# Altium schematic sheet Function.SchDoc
size A4; SheetNumber: 1; SheetTotal: 5
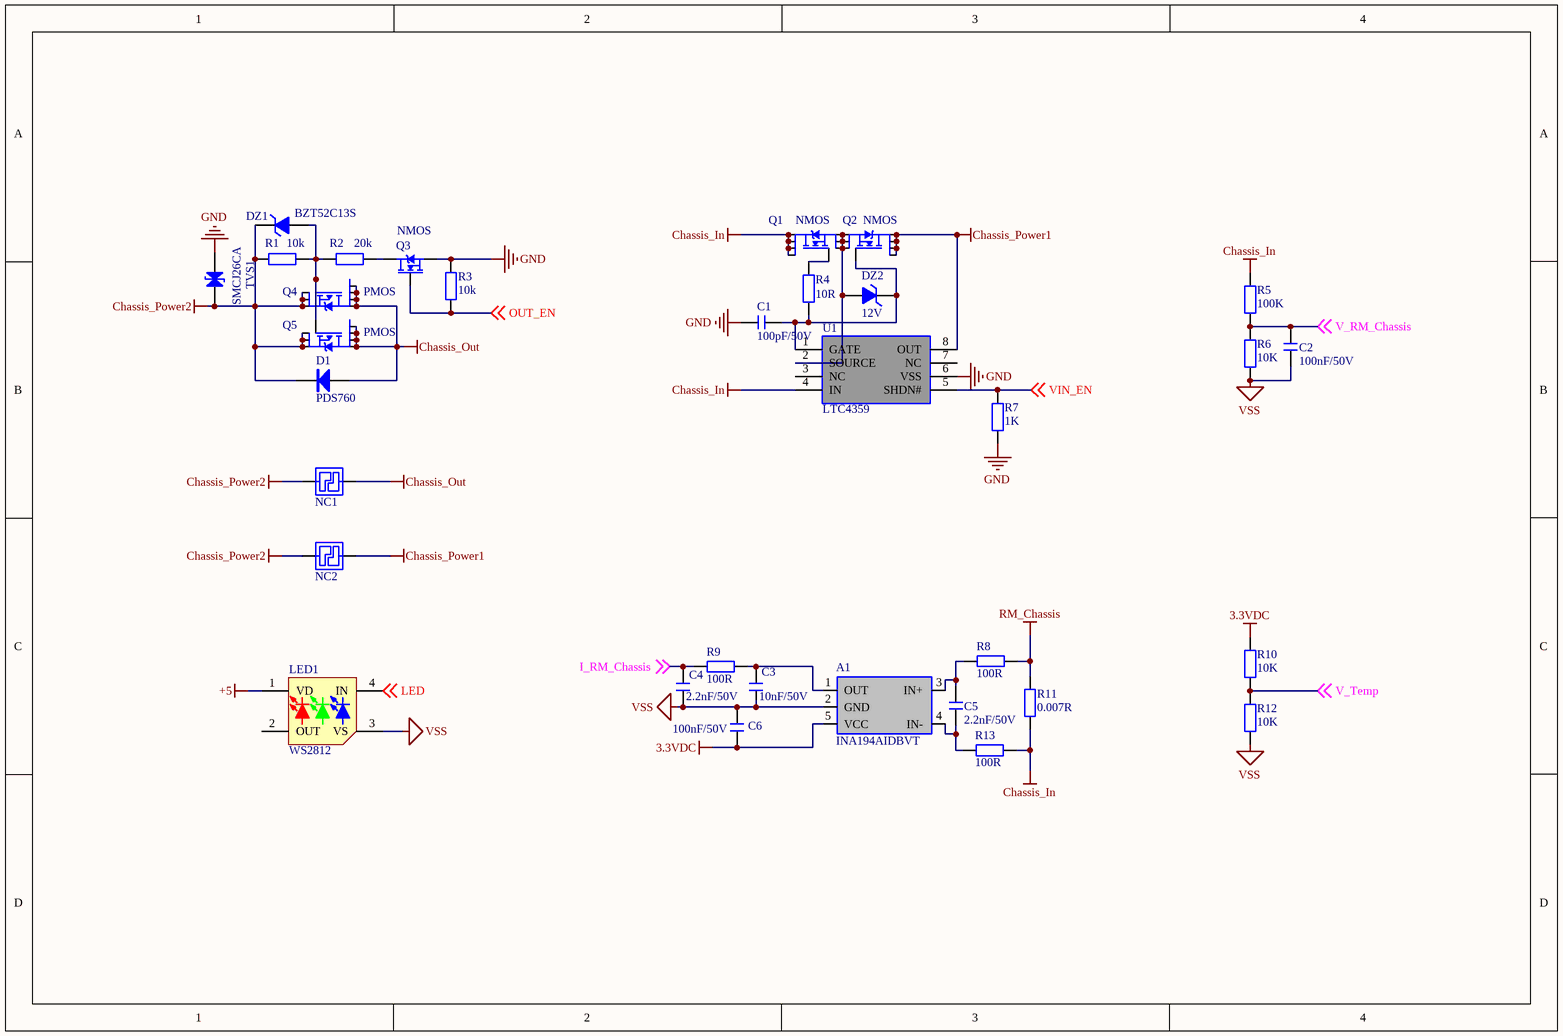
[diagram p0: Function.SchDoc]

## Parts
A1  INA194AIDBVT  [SOT23-5]
C1  100pF/50V  [C 0603_L]
C2  100nF/50V  [C 0603_L]
C3  10nF/50V  [C 0603_L]
C4  2.2nF/50V  [C 0603_L]
C5  2.2nF/50V  [C 0603_L]
C6  100nF/50V  [C 0603_L]
D1  PDS760  [SMPC]
DZ1  BZT52C13S  [SOD-323]
DZ2  12V  [SOD-323]
LED1  WS2812  [LED 3528-RGB]
NC1  NODE  [NODE-2]  (value not drawn)
NC2  NODE  [NODE-3]  (value not drawn)
Q1  NMOS  [DFN5*6-8L]
Q2  NMOS  [DFN5*6-8L]
Q3  NMOS  [SOT23-3L]
Q4  PMOS  [DFN5*6-8L]
Q5  PMOS  [DFN5*6-8L]
R1  10k  [R 0603_L]
R2  20k  [R 0603_L]
R3  10k  [R 0603_L]
R4  10R  [R 0603_L]
R5  100K  [R 0603_L]
R6  10K  [R 0603_L]
R7  1K  [R 0603_L]
R8  100R  [R 0603_L]
R9  100R  [R 0603_L]
R10  10K  [R 0603_L]
R11  0.007R  [R 2512_M]
R12  10K  [R 0603_L]
R13  100R  [R 0603_L]
TVS1  SMCJ26CA  [SMC]
U1  LTC4359  [MSOP8_L]

## Nets
3.3VDC: A1.5(VCC) C6.2 R10.1
+5: LED1.1(VD)
Chassis_In: Q1.5(D) Q1.6(D) Q1.7(D) Q1.8(D) R5.1 R11.2 R13.2 U1.4(IN)
Chassis_Out: D1.1(A) NC1.2 Q4.5(D) Q4.6(D) Q4.7(D) Q4.8(D) Q5.5(D) Q5.6(D) Q5.7(D) Q5.8(D)
Chassis_Power1: NC2.2 Q2.5(D) Q2.6(D) Q2.7(D) Q2.8(D) U1.8(OUT)
Chassis_Power2: D1.2(K) DZ1.2(K) NC1.1 NC2.1 Q4.1(S) Q4.2(S) Q4.3(S) Q5.1(S) Q5.2(S) Q5.3(S) R1.2 TVS1.2(K)
GND: C1.2 Q3.3(S) R3.1 R7.1 TVS1.1(A) U1.6(VSS)
RM_Chassis: R8.2 R11.1
VSS: A1.2(GND) C2.1 C3.2 C4.2 C6.1 LED1.3(VS) R6.2 R12.2
I_RM_Chassis: C4.1 R9.2 ; off-sheet I_RM_Chassis
LED: LED1.4(IN) ; off-sheet LED
OUT_EN: Q3.1(G) R3.2 ; off-sheet OUT_EN
V_RM_Chassis: C2.2 R5.2 R6.1 ; off-sheet V_RM_Chassis
V_Temp: R10.2 R12.1 ; off-sheet V_Temp
VIN_EN: R7.2 U1.5(SHDN#) ; off-sheet VIN_EN
NetA1_1: A1.1(OUT) C3.1 R9.1
NetA1_3: A1.3(IN+) C5.1 R8.1
NetA1_4: A1.4(IN-) C5.2 R13.1
NetC1_1: C1.1 DZ2.2(K) Q2.4(G) R4.1 U1.1(GATE)
NetDZ1_1: DZ1.1(A) Q4.4(G) Q5.4(G) R1.1 R2.1
NetDZ2_1: DZ2.1(A) Q1.1(S) Q1.2(S) Q1.3(S) Q2.1(S) Q2.2(S) Q2.3(S) U1.2(SOURCE)
NetQ1_4: Q1.4(G) R4.2
NetQ3_2: Q3.2(D) R2.2

Not connected (* = marked no-connect by the designer): LED1 2(OUT); U1 3(NC) 7(NC)

## Library data of the parts
A1 = INA194AIDBVT: 电流感应放大器 80V
C1-C6 = C: 无极性贴片电容; 版权归属: 源创客; BOM名称: 无极性贴片电容; 学习资源: www.ooocke.com
D1 = SS76: 肖特基二极管; 版权归属: 源创客; BOM名称: 肖特基二极管; 学习资源: www.ooocke.com
DZ1 DZ2 = CVD: 稳压二极管
LED1 = WS2812: 全彩可控LED; pin to pad: 1>2 2>1 3>4 4>3
NC1 NC2 = NODE: 大电流节点
Q1 Q2 = NMOS_DFN: DFN封装N沟道场效应管; BOM名称: P沟道场效应管; 版权归属: 源创客; 学习资源: www.ooocke.com
Q3 = NMOS_SS: 贴片信号N沟道场效应管; pin to pad: 2>3 3>2; 版权归属: 源创客; BOM名称: N沟道场效应管; 学习资源: www.ooocke.com
Q4 Q5 = PMOS_DFN: DFN封装P沟道场效应管; 版权归属: 源创客; BOM名称: P沟道场效应管; 学习资源: www.ooocke.com
R1-R9 R11-R13 = R: 贴片电阻; 版权归属: 源创客; BOM名称: 贴片电阻; 学习资源: www.ooocke.com
R10 = R: NTC热敏电阻; BOM名称: 贴片电阻; 版权归属: 源创客; 学习资源: www.ooocke.com
TVS1 = TVS: 瞬态电压抑制二极管; 版权归属: 源创客; BOM名称: 瞬态电压抑制二极管; 学习资源: www.ooocke.com
U1 = LTC4359: 理想二极管控制器